# EAGLE design wtv_sch (EAGLE 7.1.0)
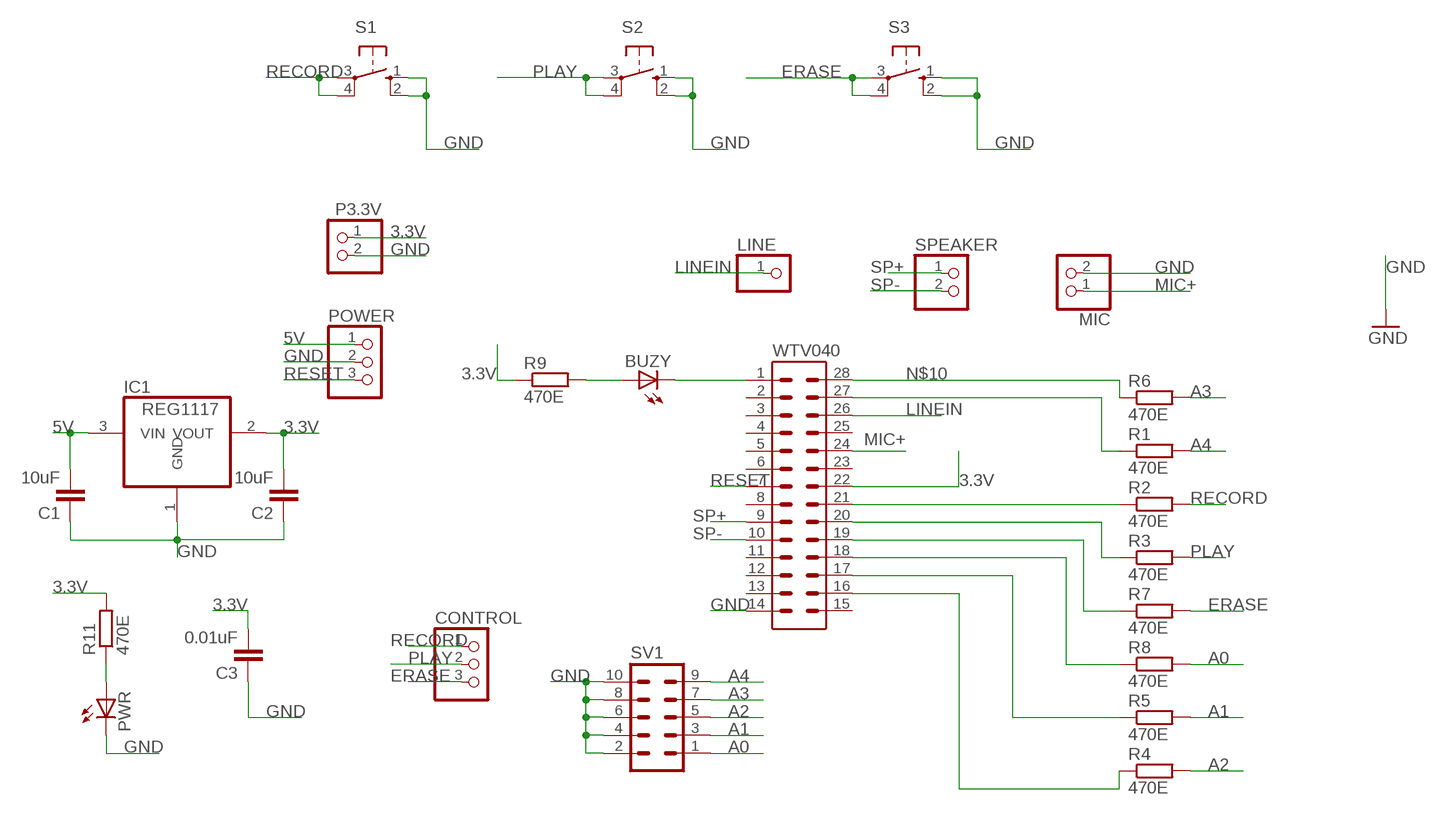
[diagram p0: schematic, sheet 1]

## Parts
BUZY  LEDSML0805  [SML0805]
C1  10uF  C-EUC0805  [C0805]
C2  10uF  C-EUC0805  [C0805]
C3  0.01uF  C-EUC0805  [C0805]
CONTROL  PINHD-1X3  [1X03]
IC1  REG1117  [SOT223]
LINE  PINHD-1X1  [1X01]
MIC  PINHD-1X2  [1X02]
P3.3V  PINHD-1X2  [1X02]
POWER  PINHD-1X3  [1X03]
PWR  LEDSML0805  [SML0805]
R1  470E  R-EU_R0805  [R0805]
R2  470E  R-EU_R0805  [R0805]
R3  470E  R-EU_R0805  [R0805]
R4  470E  R-EU_R0805  [R0805]
R5  470E  R-EU_R0805  [R0805]
R6  470E  R-EU_R0805  [R0805]
R7  470E  R-EU_R0805  [R0805]
R8  470E  R-EU_R0805  [R0805]
R9  470E  R-EU_R0805  [R0805]
R11  470E  R-EU_R0805  [R0805]
S1  10-XX  [B3F-10XX]
S2  10-XX  [B3F-10XX]
S3  10-XX  [B3F-10XX]
SPEAKER  PINHD-1X2  [1X02]
SV1  MA05-2  [MA05-2]
WTV040  IC28P  [IC28P]

## Nets
3.3V: C2.2 C3.2 IC1.2(VOUT) P3.3V.1 R9.1 R11.2 WTV040.22
5V: C1.2 IC1.3(VIN) POWER.1
A0: R8.2 SV1.1
A1: R5.2 SV1.3
A2: R4.2 SV1.5
A3: R6.2 SV1.7
A4: R1.2 SV1.9
ERASE: CONTROL.3 R7.2 S3.3(P) S3.4(P1)
GND: C1.1 C2.1 C3.1 IC1.1(GND) MIC.2 P3.3V.2 POWER.2 PWR.C S1.1(S) S1.2(S1) S2.1(S) S2.2(S1) S3.1(S) S3.2(S1) SV1.2 SV1.4 SV1.6 SV1.8 SV1.10 WTV040.14
LINEIN: LINE.1 WTV040.26
MIC+: MIC.1 WTV040.24
N$1: BUZY.A R9.2
N$2: BUZY.C WTV040.1
N$4: PWR.A R11.1
N$10: R6.1 WTV040.28
N$11: R1.1 WTV040.27
N$12: R4.1 WTV040.16
N$13: R5.1 WTV040.17
N$14: R8.1 WTV040.18
N$15: R7.1 WTV040.19
N$16: R3.1 WTV040.20
N$17: R2.1 WTV040.21
PLAY: CONTROL.2 R3.2 S2.3(P) S2.4(P1)
RECORD: CONTROL.1 R2.2 S1.3(P) S1.4(P1)
RESET: POWER.3 WTV040.7
SP+: SPEAKER.1 WTV040.9
SP-: SPEAKER.2 WTV040.10
Unconnected: WTV040.2 WTV040.3 WTV040.4 WTV040.5 WTV040.6 WTV040.8 WTV040.11 WTV040.12 WTV040.13 WTV040.15 WTV040.23 WTV040.25

## Library data of the parts
BUZY PWR = led:LED: LED OSRAM: - CHIPLED LG R971, LG N971, LY N971, LG Q971, LY Q971, LO R971, LY R971 LH N974, LH R974 LS Q976, LO Q976, LY Q976 LO Q996 - Hyper CHIPLED LW Q18S LB Q993, LB Q99A, LB R99A - SideLED LS A670, LO A670, LY A670, LG A670, LP A670 LB A673, LV A673, LT A673, LW A673 LH A674 LY A675 LS A676, LA A676, LO A676, LY A676, LW A676 LS A679, LY A679, LG A679 - Hyper Micro SIDELED® LS Y876, LA Y876, LO Y876, LY Y876 LT Y87S - SmartLED LW L88C, LW L88S LB L89C, LB L89S, LG L890 LS L89K, LO L89K, LY L89K LS L896, LA L896, LO L896, LY L896 - TOPLED LS T670, LO T670, LY T670, LG T670, LP T670 LSG T670, LSP T670, LSY T670, LOP T670, LYG T670 LG T671, LOG T671, LSG T671 LB T673, LV T673, LT T673, LW T673 LH T674 LS T676, LA T676, LO T676, LY T676, LB T676, LH T676, LSB T676, LW T676 LB T67C, LV T67C, LT T67C, LS T67K, LO T67K, LY T67K, LW E67C LS E67B, LA E67B, LO E67B, LY E67B, LB E67C, LV E67C, LT E67C LW T67C LS T679, LY T679, LG T679 LS T770, LO T770, LY T770, LG T770, LP T770 LB T773, LV T773, LT T773, LW T773 LH T774 LS E675, LA E675, LY E675, LS T675 LS T776, LA T776, LO T776, LY T776, LB T776 LHGB T686 LT T68C, LB T68C - Hyper Mini TOPLED® LB M676 - Mini TOPLED Santana® LG M470 LS M47K, LO M47K, LY M47K Source: http://www.osram.convergy.de LUXEON: - LUMILED® LXK2-PW12-R00, LXK2-PW12-S00, LXK2-PW14-U00, LXK2-PW14-V00 LXK2-PM12-R00, LXK2-PM12-S00, LXK2-PM14-U00 LXK2-PE12-Q00, LXK2-PE12-R00, LXK2-PE12-S00, LXK2-PE14-T00, LXK2-PE14-U00 LXK2-PB12-K00, LXK2-PB12-L00, LXK2-PB12-M00, LXK2-PB14-N00, LXK2-PB14-P00, LXK2-PB14-Q00 LXK2-PR12-L00, LXK2-PR12-M00, LXK2-PR14-Q00, LXK2-PR14-R00 LXK2-PD12-Q00, LXK2-PD12-R00, LXK2-PD12-S00 LXK2-PH12-R00, LXK2-PH12-S00 LXK2-PL12-P00, LXK2-PL12-Q00, LXK2-PL12-R00 Source: www.luxeon.com KINGBRIGHT: KA-3528ASYC Source: www.kingbright.com
C1-C3 = rcl:C-EU: CAPACITOR, European symbol
CONTROL POWER = pinhead:PINHD-1X3: PIN HEADER
IC1 = burr-brown:REG1117: 800mA and 1A Low Dropout (LDO) Positive Regulator 1.8V, 2.5V, 2.85V, 3.3V, 5V, and Adj; MPN: REG1117; OC_FARNELL: 1097566; OC_NEWARK: 14P6981
LINE = pinhead:PINHD-1X1: PIN HEADER
MIC P3.3V SPEAKER = pinhead:PINHD-1X2: PIN HEADER
R1-R9 R11 = rcl:R-EU_: RESISTOR, European symbol
S1-S3 = switch-omron:10-XX: OMRON SWITCH; MPN: B3F-1000; OC_FARNELL: 176432; OC_NEWARK: 36M3542
SV1 = con-lstb:MA05-2: PIN HEADER; OC_FARNELL: unknown; OC_NEWARK: unknown
WTV040 = con-dil:IC28P: DIL CABLE CONNECTOR

## Board
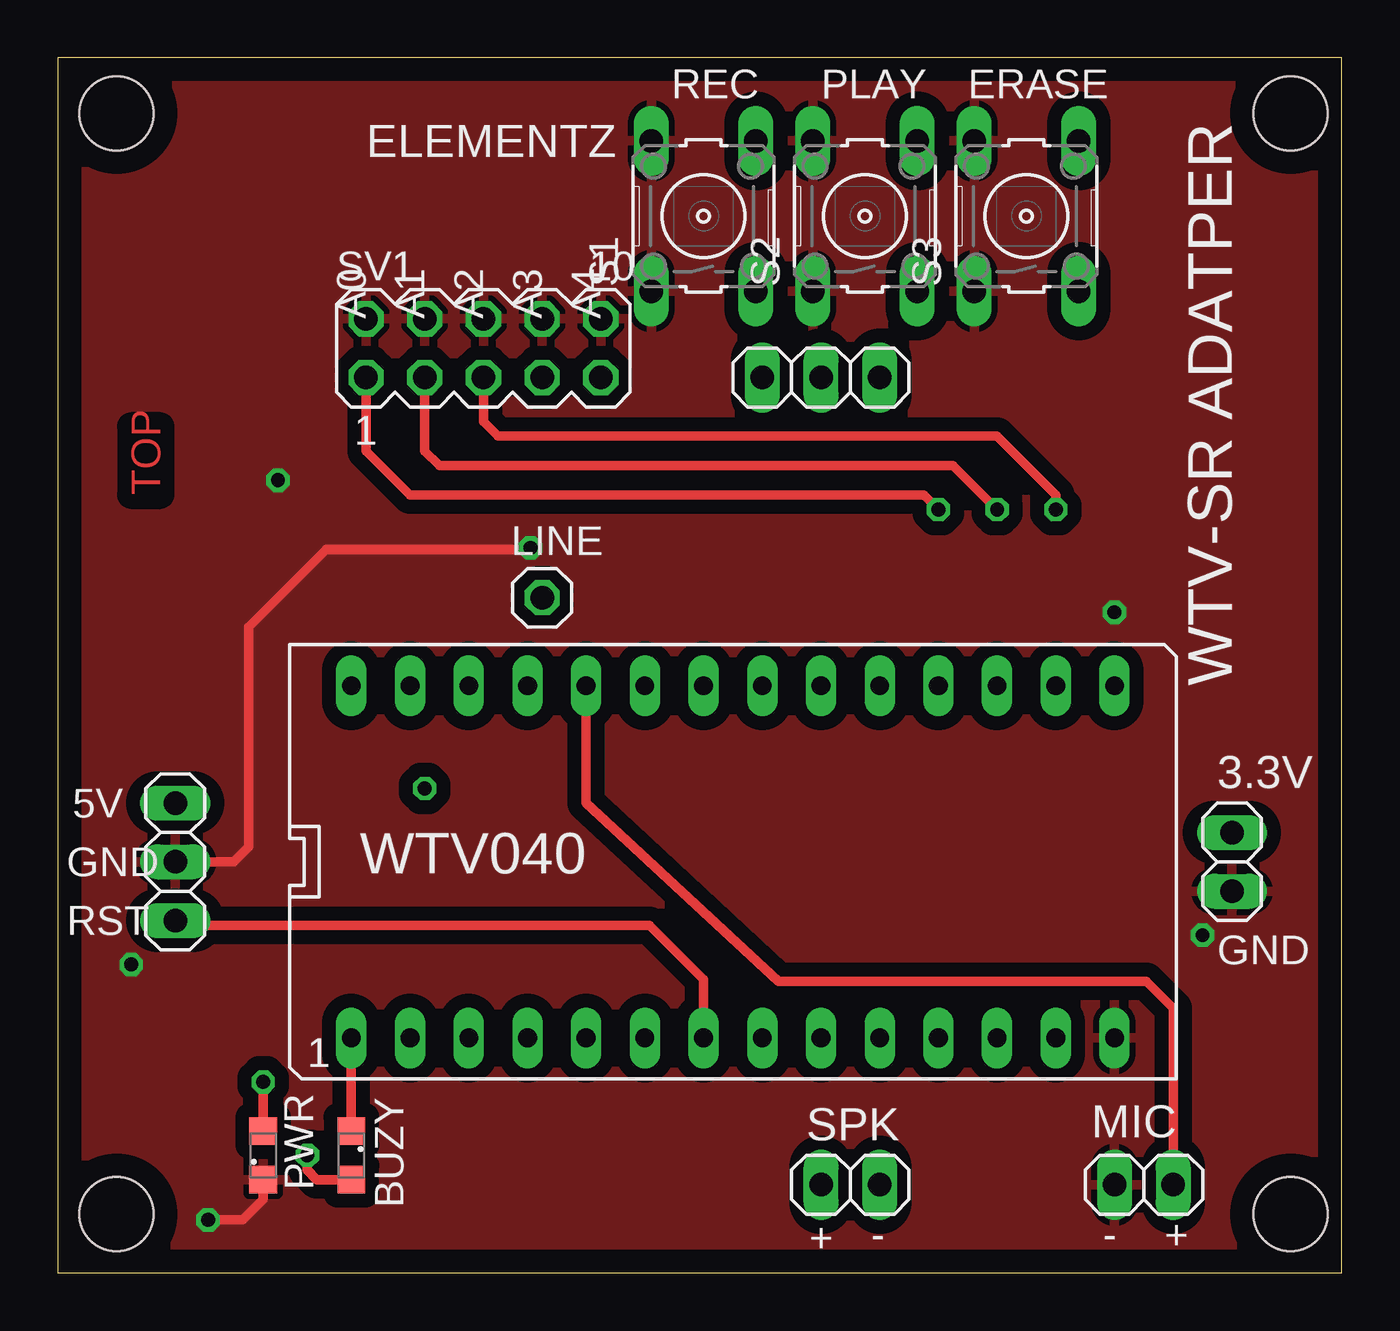
[diagram p1: board, top side]
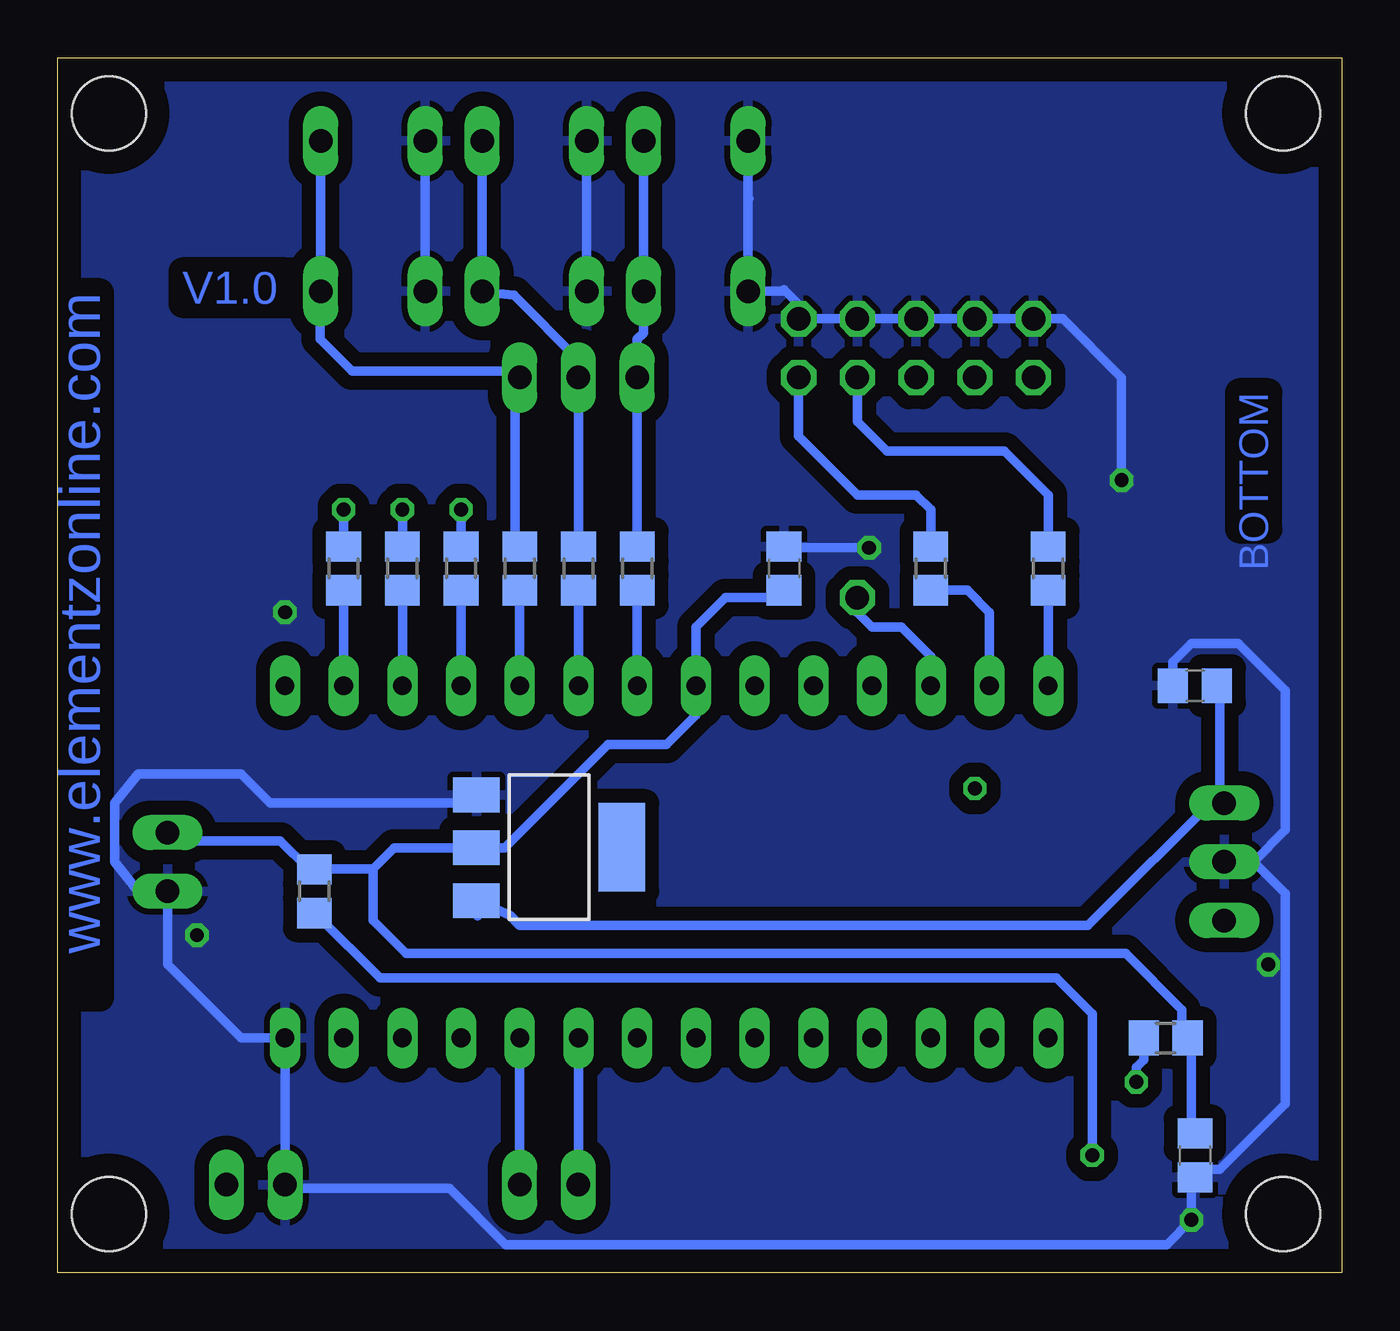
[diagram p2: board, bottom side, seen from below]

Size 55.55 x 52.57 mm. Coordinates in mm from the lower left corner, seen from the top.
Outline: 0,0 55.55,0 55.55,52.57 0,52.57 0,0
Copper layers (1*16): Top 0.035mm / dielectric 1.5mm / Bottom 0.035mm
Design rules "Elementz *": minimum track width 16mil, minimum drill 24mil, track to track 24mil, track to pad 30mil, pad to pad 16mil, via to via 16mil, smd to smd 16mil, copper to edge 40mil, drill to drill 8mil, minimum pad ring 10mil, minimum via ring 8mil, stop-mask expansion 4mil, vias tented up to drill 0mil, thermal gap 10mil
Holes 3.2 mm at 2.54,50.16 53.34,50.16 53.34,2.54 2.54,2.54

### Footprints (pad centres in the part's own frame; a part is rotated, then mirrored left to right if it is on the bottom)
SML0805 = smd 1.2 x 1.2: A 1.05,0; C -1.05,0
C0805 = smd 1.3 x 1.5: 1 -0.95,0; 2 0.95,0
1X03 = drill 1.016 long: 1 -2.54,0; 2 0,0; 3 2.54,0
SOT223 = smd 1.499 x 2.007: 1 -2.261,-3.15; 2 0.025,-3.15; 3 2.311,-3.15 | smd 3.81 x 2.007: 4 0,3.15
1X01 = drill 1.016 octagon: 1 0,0
1X02 = drill 1.016 long: 1 -1.27,0; 2 1.27,0
R0805 = smd 1.3 x 1.5: 1 -0.95,0; 2 0.95,0
B3F-10XX = drill 1.016 long: 1 -3.251,2.261; 2 3.251,2.261; 3 -3.251,-2.261; 4 3.251,-2.261
MA05-2 = drill 1.016 octagon: 1 -5.08,-1.27; 2 -5.08,1.27; 3 -2.54,-1.27; 4 -2.54,1.27; 5 0,-1.27; 6 0,1.27; 7 2.54,-1.27; 8 2.54,1.27; 9 5.08,-1.27; 10 5.08,1.27
IC28P = drill 0.813 long: 1 -16.51,-7.62; 2 -13.97,-7.62; 3 -11.43,-7.62; 4 -8.89,-7.62; 5 -6.35,-7.62; 6 -3.81,-7.62; 7 -1.27,-7.62; 8 1.27,-7.62; 9 3.81,-7.62; 10 6.35,-7.62; 11 8.89,-7.62; 12 11.43,-7.62; 13 13.97,-7.62; 14 16.51,-7.62; 15 16.51,7.62; 16 13.97,7.62; 17 11.43,7.62; 18 8.89,7.62; 19 6.35,7.62; 20 3.81,7.62; 21 1.27,7.62; 22 -1.27,7.62; 23 -3.81,7.62; 24 -6.35,7.62; 25 -8.89,7.62; 26 -11.43,7.62; 27 -13.97,7.62; 28 -16.51,7.62

### Placement (x,y rotation side)
BUZY  12.7,5.08 270 top
C1  6.35,25.4 0 bottom
C2  6.35,5.08 90 bottom
C3  24.13,30.48 270 bottom
CONTROL  33.02,38.73 0 top
IC1  34.29,18.41 270 bottom
LINE  20.95,29.21 0 top
MIC  46.99,3.81 180 top
P3.3V  50.8,17.78 270 top
POWER  5.08,17.78 270 top
PWR  8.89,5.08 90 top
R1  17.78,30.48 90 bottom
R2  30.48,30.48 90 bottom
R3  33.02,30.48 90 bottom
R4  43.18,30.48 90 bottom
R5  40.64,30.48 90 bottom
R6  12.7,30.48 90 bottom
R7  35.56,30.48 90 bottom
R8  38.1,30.48 90 bottom
R9  44.45,16.51 270 bottom
R11  7.62,10.16 0 bottom
S1  27.94,45.72 90 top
S2  34.92,45.72 90 top
S3  41.91,45.72 90 top
SPEAKER  34.29,3.81 0 top
SV1  18.41,40.01 0 top
WTV040  29.21,17.78 0 top

### Tracks (layer width: path | path; a pad name or v marks a point on that pad's centre or on a via)
3.3V
  Bottom 0.406: 24.38,29.26 C3.2 24.45,29.21 26.67,29.21 27.94,27.94 WTV040.22 27.94,24.13 29.21,22.86 31.75,22.86 36.22,18.39 IC1.2 41,18.39 41.91,17.48 | C2.2 6.5,6.1 6.5,10.16 R11.2 6.91,10.16 6.91,11.38 9.35,13.82 40.49,13.82 41.91,15.24 41.91,17.48 | 41.91,17.48 44.3,17.48 R9.1 44.7,17.48 45.92,18.69 50.8,18.69 P3.3V.1
5V
  Bottom 0.406: 5.28,20.73 5.28,20.32 POWER.1 5.28,20.73 | 5.28,20.73 5.28,25.2 C1.2 | 5.28,20.73 10.97,15.04 35.56,15.04 35.99,15.47 IC1.3 37.39,15.44
A0  (via drill 0.6)
  Top 0.406: v38.1,33.02 37.47,33.66 15.24,33.66 13.34,35.56 SV1.1
  Bottom 0.406: R8.2 v38.1,33.02
A1  (via drill 0.6)
  Top 0.406: v40.64,33.02 38.73,34.92 16.51,34.92 15.88,35.56 SV1.3
  Bottom 0.406: R5.2 v40.64,33.02
A2  (via drill 0.6)
  Top 0.406: v43.18,33.02 43.18,33.66 40.64,36.2 19.05,36.2 18.41,36.83 SV1.5
  Bottom 0.406: R4.2 v43.18,33.02
A3
  Bottom 0.406: R6.2 12.7,33.66 14.61,35.56 19.68,35.56 20.95,36.83 SV1.7
A4
  Bottom 0.406: R1.2 17.78,33.02 18.41,33.66 20.95,33.66 23.5,36.2 SV1.9
ERASE
  Bottom 0.406: 35.76,39.01 35.76,31.7 R7.2 | 35.76,39.01 CONTROL.3 | 35.76,39.01 42.82,39.01 44.2,40.39 44.2,42.44 S3.3 S3.4
GND  (via drill 0.6, 0.6 pad 1.02)
  Top 0.406: 5.28,17.48 POWER.2 7.62,17.78 8.26,18.41 8.26,27.94 11.61,31.29 20.37,31.29 v20.45,31.37 20.14,31.29 | 8.94,3.66 PWR.C 8.89,3.17 8,2.29 v6.5,2.29
  Bottom 0.406: 51.61,16.66 50.8,16.66 P3.3V.2 | IC1.1 37.8,20.32 46.35,20.32 47.62,21.59 52.07,21.59 53.09,20.32 53.09,17.78 52.07,16.51 P3.3V.2 | POWER.2 4.88,17.48 4.47,17.88 POWER.2 | 23.98,31.29 C3.1 24.07,31.37 v20.45,31.37 | 3.81,17.78 2.44,16.41 2.44,7.32 5.28,4.47 6.1,4.47 C2.1 6.5,4.06 v6.5,2.29 7.57,1.22 36.17,1.22 38.61,3.66 45.52,3.66 MIC.2 WTV040.14 47.62,10.16 50.8,13.34 P3.3V.2 | 3.81,17.78 POWER.2 | 3.81,17.78 2.44,19.15 2.44,25.2 4.47,27.23 6.5,27.23 7.3,26.43 C1.1 | v9.53,34.29 9.53,38.73 12.06,41.27 SV1.2 SV1.4 SV1.6 SV1.8 SV1.10 23.5,41.91 24.13,42.55 24.21,42.47 S1.1 25.68,46.46 25.65,46.48 25.68,46.51 S1.2 | S2.1 S2.2 32.64,49 | S3.1 S3.2
  other vias: 45.72,28.57 49.53,14.61 3.17,13.34
  pour Bottom: -1.27,53.34 -1.27,-1.91 57.15,-1.91 57.15,53.34
  pour Top: 57.15,53.34 57.15,-1.27 -0.64,-1.27 -0.64,53.34
LINEIN
  Bottom 0.406: WTV040.26 17.78,26.67 19.05,27.94 20.32,27.94 20.95,28.57 LINE.1
MIC+
  Top 0.406: WTV040.24 22.86,20.32 31.19,12.6 47.09,12.6 48.26,11.43 MIC.1
N$1  (via drill 0.6)
  Top 0.406: BUZY.A 11.21,4.03 10.79,4.45 v10.79,5.08
  Bottom 0.406: R9.2 44.3,15.44 41.6,12.75 12.34,12.75 10.79,11.2 v10.79,5.08
N$2
  Top 0.406: BUZY.C WTV040.1
N$3  (via drill 0.6)
  other vias: 15.88,20.95
N$4  (via drill 0.6)
  Top 0.406: PWR.A 8.94,6.5 8.89,6.5 v8.89,8.26
  Bottom 0.406: 8.94,10.16 R11.1 8.57,9.21 8.89,8.89 v8.89,8.26
N$10
  Bottom 0.406: WTV040.28 R6.1
N$11
  Bottom 0.406: WTV040.27 15.24,28.57 16.2,29.53 R1.1
N$12
  Bottom 0.406: WTV040.16 R4.1
N$13
  Bottom 0.406: WTV040.17 R5.1
N$14
  Bottom 0.406: WTV040.18 R8.1
N$15
  Bottom 0.406: WTV040.19 R7.1
N$16
  Bottom 0.406: WTV040.20 R3.1
N$17
  Bottom 0.406: WTV040.21 R2.1
PLAY
  Bottom 0.406: R3.2 CONTROL.2 33.02,39.5 35.81,42.29 37.13,42.42 S2.3 S2.4
RECORD
  Bottom 0.406: R2.2 CONTROL.1 30.48,40.39 30.2,40.66 S1.3 S1.4
RESET
  Top 0.406: POWER.3 5.28,15.04 25.6,15.04 27.94,12.7 WTV040.7
SP+
  Bottom 0.406: SPEAKER.1 WTV040.9
SP-
  Bottom 0.406: SPEAKER.2 WTV040.10

### Text on the board
Top: TOP
Bottom: V1.0 | www.elementzonline.com | BOTTOM
tPlace: REC | PLAY | ERASE | ELEMENTZ | A0 | A1 | A2 | A3 | A4 | WTV-SR ADATPER | 3.3V | 5V | GND | RST | GND | SPK | MIC | + | - | - | +